# Altium schematic sheet 6-CodSwitch.SchDoc
size A4
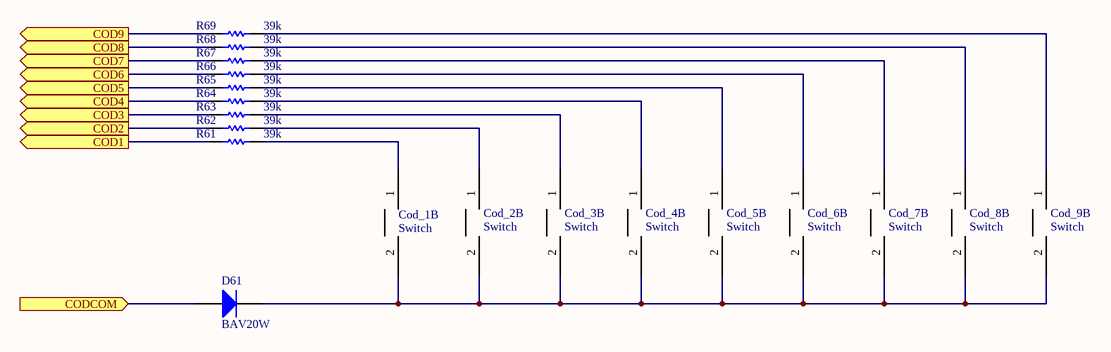
[diagram p0: 6-CodSwitch.SchDoc]

## Parts
Cod_1  Switch  [PEC11R-4xxxF-Sxxxx]  (part B of 2)
Cod_2  Switch  [PEC11R-4xxxF-Sxxxx]  (part B of 2)
Cod_3  Switch  [PEC11R-4xxxF-Sxxxx]  (part B of 2)
Cod_4  Switch  [PEC11R-4xxxF-Sxxxx]  (part B of 2)
Cod_5  Switch  [PEC11R-4xxxF-Sxxxx]  (part B of 2)
Cod_6  Switch  [PEC11R-4xxxF-Sxxxx]  (part B of 2)
Cod_7  Switch  [PEC11R-4xxxF-Sxxxx]  (part B of 2)
Cod_8  Switch  [PEC11R-4xxxF-Sxxxx]  (part B of 2)
Cod_9  Switch  [PEC11R-4xxxF-Sxxxx]  (part B of 2)
D61  BAV20W  [Diode SOD-123]
R61  39k  [RES 1206]
R62  39k  [RES 1206]
R63  39k  [RES 1206]
R64  39k  [RES 1206]
R65  39k  [RES 1206]
R66  39k  [RES 1206]
R67  39k  [RES 1206]
R68  39k  [RES 1206]
R69  39k  [RES 1206]

## Ports
COD1 (out), COD2 (out), COD3 (out), COD4 (out), COD5 (out), COD6 (out), COD7 (out), COD8 (out), COD9 (out), CODCOM (in)

## Nets
COD1: R61.1 ; port COD1
COD2: R62.1 ; port COD2
COD3: R63.1 ; port COD3
COD4: R64.1 ; port COD4
COD5: R65.1 ; port COD5
COD6: R66.1 ; port COD6
COD7: R67.1 ; port COD7
COD8: R68.1 ; port COD8
COD9: R69.1 ; port COD9
CODCOM: D61.1(A) ; port CODCOM
NetCod_1_1: Cod_1.1 R61.2
NetCod_1_2: Cod_1.2 Cod_2.2 Cod_3.2 Cod_4.2 Cod_5.2 Cod_6.2 Cod_7.2 Cod_8.2 Cod_9.2 D61.2(K)
NetCod_2_1: Cod_2.1 R62.2
NetCod_3_1: Cod_3.1 R63.2
NetCod_4_1: Cod_4.1 R64.2
NetCod_5_1: Cod_5.1 R65.2
NetCod_6_1: Cod_6.1 R66.2
NetCod_7_1: Cod_7.1 R67.2
NetCod_8_1: Cod_8.1 R68.2
NetCod_9_1: Cod_9.1 R69.2

## Library data of the parts
Cod_1-Cod_8 = Cod: Fabricant: BOURNS; Fournisseur: Farnell; RefFabricant: PEC11R-4020F-S0024; RefFournisseur: 2663519
Cod_9 = Cod: Fabricant: BOURNS; Fournisseur: Farnell; RefFabricant: PEC11R-4220F-S0024; RefFournisseur: 2663527
D61 = Diode: Default Diode; Fabricant: DIODES INC.; Fournisseur: Farnell; RefFournisseur: 1902417; RefFabricant: BAV20W
R61-R69 = Res1: Resistor; Fabricant: MULTICOMP; Fournisseur: Farnell; RefFabricant: MC0125W1206539K; RefFournisseur: 9337407